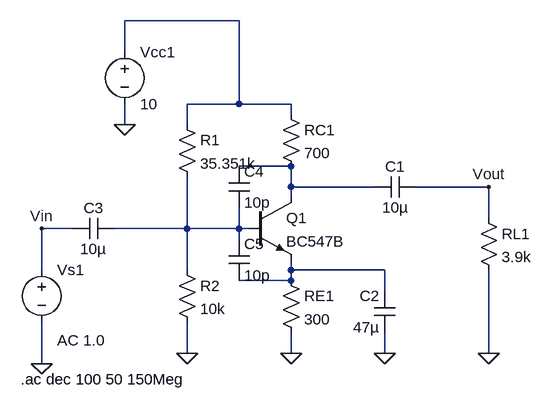
[diagram p0: schematic lab7.1h.asc]
lab7.1h.asc, the LTspice schematic file:
Version 4
SHEET 1 880 680
WIRE 48 -112 -128 -112
WIRE -128 -64 -128 -112
WIRE 48 16 48 -112
WIRE 48 16 -32 16
WIRE 128 16 48 16
WIRE 128 32 128 16
WIRE -128 48 -128 16
WIRE -32 48 -32 16
WIRE 128 112 48 112
WIRE 128 144 128 112
WIRE 256 144 128 144
WIRE 432 144 320 144
WIRE 128 160 128 144
WIRE 432 192 432 144
WIRE -208 208 -256 208
WIRE -32 208 -32 128
WIRE -32 208 -144 208
WIRE 48 208 48 176
WIRE 48 208 -32 208
WIRE 64 208 48 208
WIRE 48 224 48 208
WIRE -256 272 -256 208
WIRE -32 272 -32 208
WIRE 128 272 128 256
WIRE 272 272 128 272
WIRE 128 288 128 272
WIRE 128 288 48 288
WIRE 272 304 272 272
WIRE -32 400 -32 352
WIRE 128 400 128 368
WIRE 272 400 272 368
WIRE 432 400 432 272
WIRE -256 416 -256 352
FLAG -256 416 0
FLAG -32 400 0
FLAG 128 400 0
FLAG 272 400 0
FLAG 432 400 0
FLAG -128 48 0
FLAG 432 144 Vout
FLAG -256 208 Vin
SYMBOL voltage -256 256 R0
WINDOW 123 24 124 Left 2
WINDOW 39 0 0 Left 0
SYMATTR Value2 AC 1.0
SYMATTR InstName Vs1
SYMATTR Value ""
SYMBOL res -48 32 R0
SYMATTR InstName R1
SYMATTR Value 35.351k
SYMBOL res -48 256 R0
SYMATTR InstName R2
SYMATTR Value 10k
SYMBOL res 112 16 R0
SYMATTR InstName RC1
SYMATTR Value 700
SYMBOL res 112 272 R0
SYMATTR InstName RE1
SYMATTR Value 300
SYMBOL cap 320 128 R90
WINDOW 0 0 32 VBottom 2
WINDOW 3 32 32 VTop 2
SYMATTR InstName C1
SYMATTR Value 10µ
SYMBOL cap 288 368 R180
WINDOW 0 24 56 Left 2
WINDOW 3 24 8 Left 2
SYMATTR InstName C2
SYMATTR Value 47µ
SYMBOL res 416 176 R0
SYMATTR InstName RL1
SYMATTR Value 3.9k
SYMBOL npn 64 160 R0
SYMATTR InstName Q1
SYMATTR Value BC547B
SYMBOL voltage -128 -80 R0
SYMATTR InstName Vcc1
SYMATTR Value 10
SYMBOL cap -144 192 R90
WINDOW 0 0 32 VBottom 2
WINDOW 3 32 32 VTop 2
SYMATTR InstName C3
SYMATTR Value 10µ
SYMBOL cap 32 112 R0
SYMATTR InstName C4
SYMATTR Value 10p
SYMBOL cap 32 224 R0
SYMATTR InstName C5
SYMATTR Value 10p
TEXT -288 440 Left 2 !.ac dec 100 50 150Meg

The netlist it stands for:
* lab7.1h.asc
Vs1 Vin 0 AC 1.0
R1 N001 N003 35.351k
R2 N003 0 10k
RC1 N001 N002 700
RE1 N004 0 300
C1 Vout N002 10µ
C2 0 N004 47µ
RL1 Vout 0 3.9k
Q1 N002 N003 N004 0 BC547B
Vcc1 N001 0 10
C3 N003 Vin 10µ
C4 N002 N003 10p
C5 N003 N004 10p
.model NPN NPN
.model PNP PNP
.lib standard.bjt
.ac dec 100 50 150Meg
.backanno
.end